# Altium project Back.PrjPcb
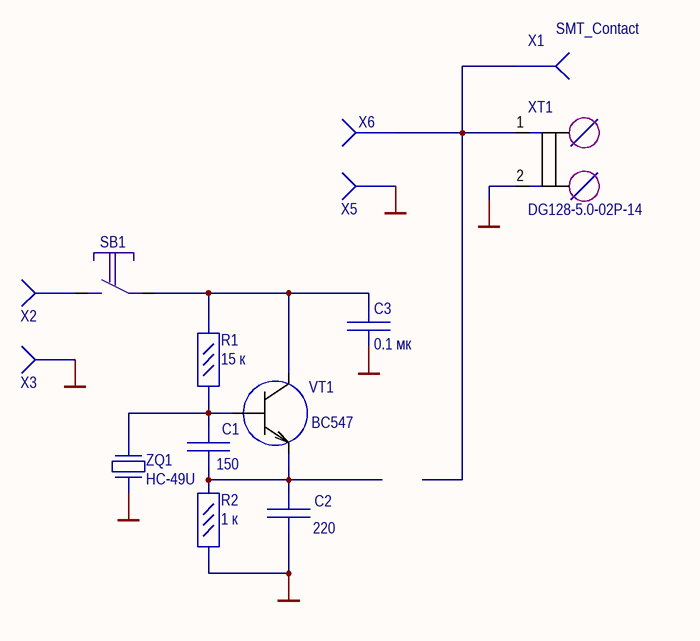
[diagram p0: Sheet1.SchDoc]
1 sheet, 14 parts. Net scope: global (net labels, ports and power ports of the same name join across sheets).
Board files: PCB1.PcbDoc, Multiboard_Back.PcbDoc

## Sheet Sheet1.SchDoc: Наименование
size 420 x 297 mm; ApprovedBy: Утвердил; CheckedBy: Проверил; Author: Разработал; CompanyName: Организация; DrawnBy: Н.Контр; Engineer: Т.Контр; SheetNumber: 1; SheetTotal: 1; PageSetup: Record=PageOptions|CenterHorizontal=True|CenterVertical=True|PrintScale=0.94|XCorrection=1.00|YCorrection=1.00|PrintKind=1|BorderSize=5000000|LeftOffset=0|BottomOffset=0|Orientation=1|PaperLength=1000|PaperWidth=1000|Scale=100|PaperSource=7|PrintQuality=-4|MediaType=1|DitherType=10|PaperKind=A4|PrintScaleMode=1; DecimalNumber: Децимальный номер; HeadOfSector: Нач. сектора; MainDevice: Перв.примен.; Name: Наименование; DocumentName: Sheet1.SCHDOC

### Parts
C1  150  [К10-17Б]
C2  220  [К10-17Б]
C3  0.1 мк  [К10-17Б]
R1  15 к  [С1-4]
R2  1 к  [С1-4]
SB1  KLS7-TS6601  [KLS7-TS6601]  (value not drawn)
VT1  BC547  [КТ-26]
X1  SMT_Contact  [SMT_CONTACT_TYPE_3]
X2  SMT_Contact  [SMT_CONTACT_TYPE_1]  (value not drawn)
X3  SMT_Contact  [SMT_CONTACT_TYPE_1]  (value not drawn)
X5  SMT_Contact  [SMT_CONTACT_TYPE_1]  (value not drawn)
X6  SMT_Contact  [SMT_CONTACT_TYPE_1]  (value not drawn)
XT1  DG128-5.0-02P-14  [DG128-5.0-02P-14]
ZQ1  HC-49U  [HC-49U]

### Nets
GND: C2.2 C3.1 R2.1 X3.1 X5.1 XT1.2 ZQ1.2
NetC1_1: C1.1 R1.1 VT1.2(B) ZQ1.1
NetC1_2: C1.2 C2.1 R2.2 VT1.3(E)
NetC3_2: C3.2 R1.2 SB1.2 VT1.1(C)
NetSB1_1: SB1.1 X2.1
NetX1_1: X1.1 X6.1 XT1.1

### Notes on the sheet
- Перв.примен.
- Справ.№
- Подп. и дата
- Инв.№ дубл.
- Взам.инв.№
- Подп.и дата
- Разраб.
- Изм.
- Лист
- № докум.
- Подп.
- Дата
- Лит.
- Масштаб
- Масса
- Т.контр.
- Пров.
- СХЕМА   ЭЛЕКТРИЧЕСКАЯ
- ПРИНЦИПИАЛЬНАЯ
- Листов
- Инв.№ подл.
- Утв.
- Н.контр.
- Нач.сект.
- Формат  A3

### Library data of the parts
C1-C3 = C_К10-17Б
R1 R2 = R_C1-4